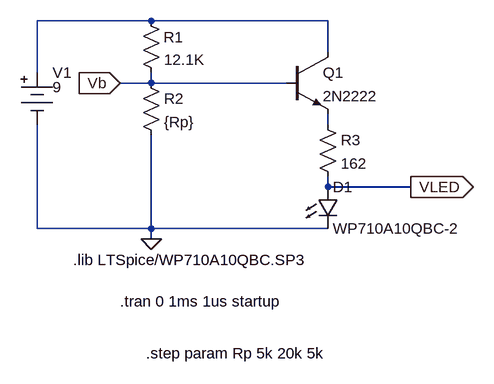
[diagram p0: schematic Photosensor.asc]
Photosensor.asc, the LTspice schematic file:
Version 4
SHEET 1 936 680
WIRE 32 16 -144 16
WIRE 304 16 32 16
WIRE 304 64 304 16
WIRE -144 96 -144 16
WIRE 32 112 32 96
WIRE 32 112 -16 112
WIRE 240 112 32 112
WIRE 304 176 304 160
WIRE 304 272 304 256
WIRE 432 272 304 272
WIRE -144 336 -144 176
WIRE 32 336 32 192
WIRE 32 336 -144 336
WIRE 304 336 32 336
WIRE 32 352 32 336
FLAG 32 352 0
FLAG -16 112 Vb
IOPIN -16 112 In
FLAG 432 272 VLED
IOPIN 432 272 Out
SYMBOL battery -144 80 R0
WINDOW 123 0 0 Left 2
WINDOW 3 24 38 Left 2
SYMATTR Value 9
SYMATTR InstName V1
SYMATTR SpiceLine Rser=0
SYMBOL res 16 0 R0
WINDOW 0 35 41 Left 2
SYMATTR InstName R1
SYMATTR Value 12.1K
SYMBOL res 16 96 R0
SYMATTR InstName R2
SYMATTR Value {Rp}
SYMBOL res 288 160 R0
SYMATTR InstName R3
SYMATTR Value 162
SYMBOL npn 240 64 R0
SYMATTR InstName Q1
SYMATTR Value 2N2222
SYMBOL LED 288 272 R0
SYMATTR InstName D1
SYMATTR Value WP710A10QBC-2
TEXT -88 384 Left 2 !.lib LTSpice/WP710A10QBC.SP3
TEXT -16 448 Left 2 !.tran 0 1ms 1us startup
TEXT 24 528 Left 2 !.step param Rp 5k 20k 5k

The netlist it stands for:
* Photosensor.asc
V1 N001 0 9 Rser=0
R1 N001 Vb 12.1K
R2 Vb 0 {Rp}
R3 N002 VLED 162
Q1 N001 Vb N002 0 2N2222
D1 VLED 0 WP710A10QBC-2
.model D D
.lib standard.dio
.model NPN NPN
.model PNP PNP
.lib standard.bjt
.lib LTSpice/WP710A10QBC.SP3
.tran 0 1ms 1us startup
.step param Rp 5k 20k 5k
.backanno
.end

* Results of the author's LTspice run, read from the files saved beside the schematic
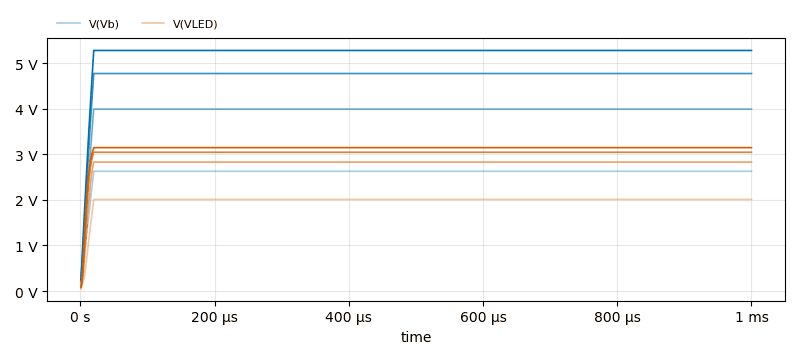
[diagram p1: Transient Analysis of Photosensor.asc, plotted from the saved traces]
* Transient Analysis, 7 runs:
*   V(Vb) [run 1]: min 132.1 mV, max 2.632 V, average 2.606 V, rms 2.613 V, last 2.63 V
*   V(Vb) [run 2]: 195.3 mV at time=1 µs, 195.3 mV at time=1 µs, min 195.3 mV, max 195.3 mV
*   V(Vb) [run 3]: min 195.3 mV, max 3.997 V, average 3.959 V, rms 3.97 V, last 3.995 V
*   V(Vb) [run 4]: 231.6 mV at time=1 µs, 231.6 mV at time=1 µs, min 231.6 mV, max 231.6 mV
*   V(Vb) [run 5]: min 231.6 mV, max 4.778 V, average 4.734 V, rms 4.747 V, last 4.775 V
*   V(Vb) [run 6]: 255 mV at time=1 µs, 255 mV at time=1 µs, min 255 mV, max 255 mV
*   V(Vb) [run 7]: min 255 mV, max 5.284 V, average 5.236 V, rms 5.25 V, last 5.282 V
*   V(VLED) [run 1]: min 49.32 mV, max 2.012 V, average 1.99 V, rms 1.998 V, last 2.011 V
*   V(VLED) [run 2]: 73.02 mV at time=1 µs, 73.02 mV at time=1 µs, min 73.02 mV, max 73.02 mV
*   V(VLED) [run 3]: min 73.02 mV, max 2.832 V, average 2.806 V, rms 2.815 V, last 2.832 V
*   V(VLED) [run 4]: 86.7 mV at time=1 µs, 86.7 mV at time=1 µs, min 86.7 mV, max 86.7 mV
*   V(VLED) [run 5]: min 86.7 mV, max 3.048 V, average 3.023 V, rms 3.031 V, last 3.047 V
*   V(VLED) [run 6]: 95.55 mV at time=1 µs, 95.55 mV at time=1 µs, min 95.55 mV, max 95.55 mV
*   V(VLED) [run 7]: min 95.55 mV, max 3.149 V, average 3.126 V, rms 3.133 V, last 3.149 V